# Altium project PWR MOD 1.0 B.PrjPcb
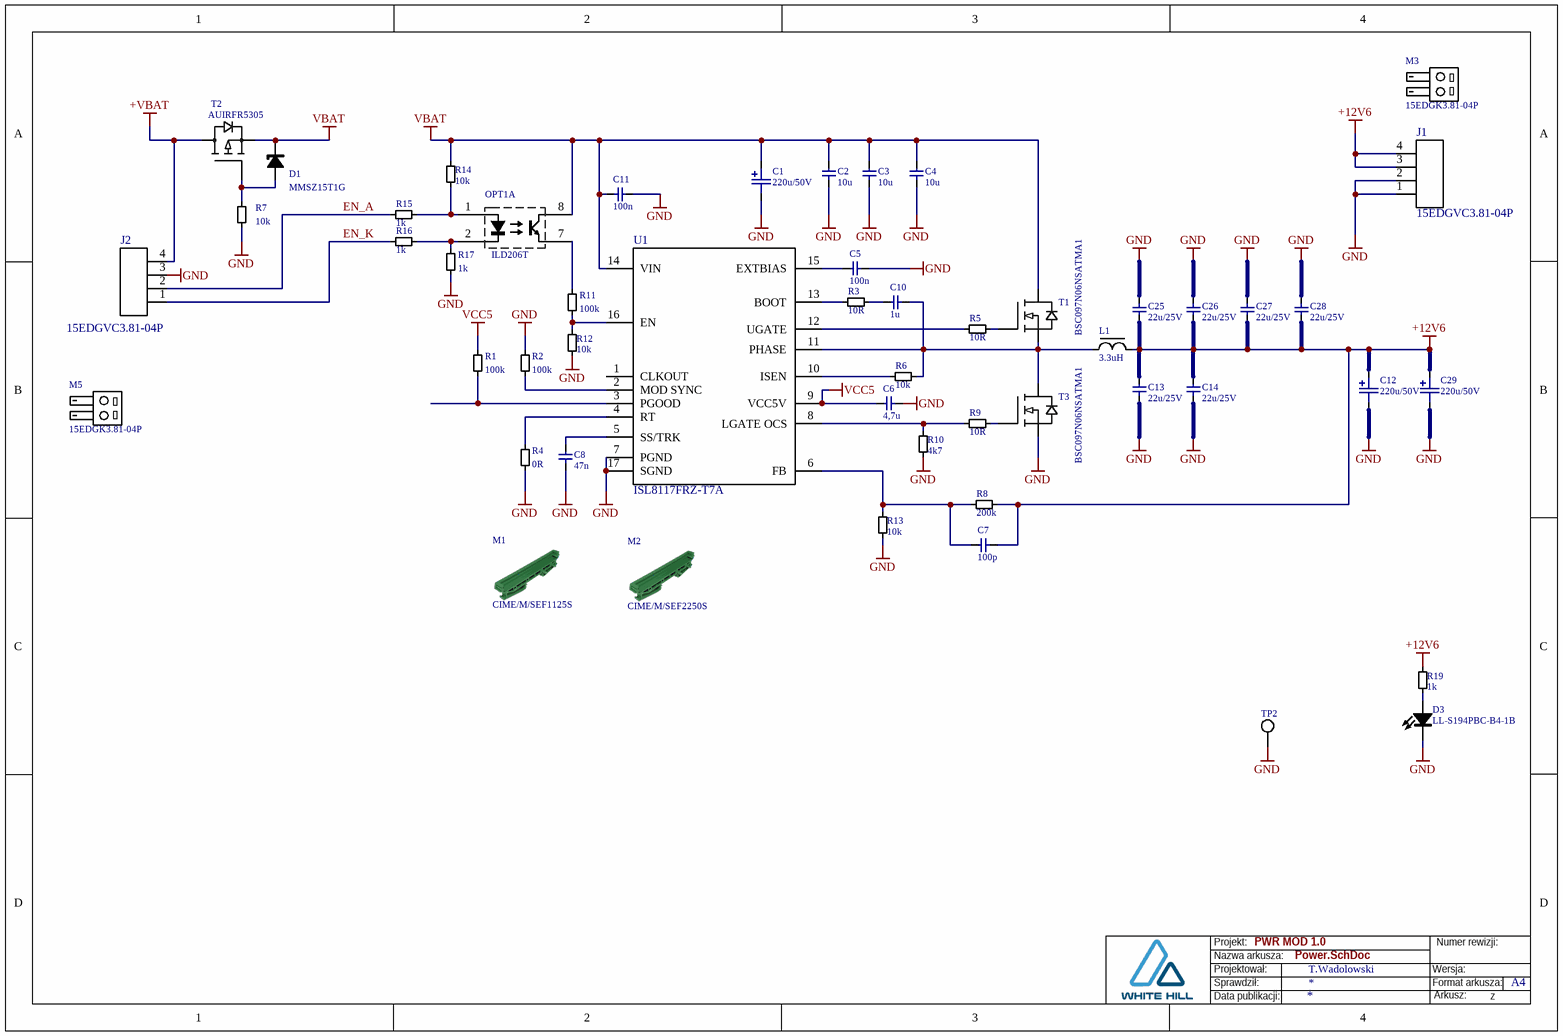
[diagram p0: Power.SchDoc]
PRJ_Title: PWR MOD 1.0
1 sheet, 51 parts. Net scope: global (net labels, ports and power ports of the same name join across sheets).
Board file: PWR MOD 1.0 B.PcbDoc

## Sheet Power.SchDoc
size A4; Engineer: T.Wadolowski; Address1: Whitehill Sp.z o.o Sp.k; Address4: ul.Żurawia 71; DocumentNumber: 1.0

### Parts
C1  220u/50V  [ALU-G]
C2  10u  [C1206]
C3  10u  [C1206]
C4  10u  [C1206]
C5  100n  [C0603]
C6  4,7u  [C0603]
C7  100p  [C0603]
C8  47n  [C0603]
C10  1u  [C0805-10]
C11  100n  [C0603]
C12  220u/50V  [ALU-G]
C13  22u/25V  [C1206]
C14  22u/25V  [C1206]
C25  22u/25V  [C1206]
C26  22u/25V  [C1206]
C27  22u/25V  [C1206]
C28  22u/25V  [C1206]
C29  220u/50V  [ALU-G]
D1  MMSZ15T1G  [SOD123]
D3  LL-S194PBC-B4-1B  [LED0603B]
J1  15EDGVC3.81-04P  [MCV1,5/4-G3,81]
J2  15EDGVC3.81-04P  [MCV1,5/4-G3,81]
L1  3.3uH  [HPI1260]
M1  CIME/M/SEF1125S  (mechanical)
M2  CIME/M/SEF2250S  (mechanical)
M3  15EDGK3.81-04P  (mechanical)
M5  15EDGK3.81-04P  (mechanical)
OPT1  ILD206T  [SO-8-OPT]  (part A of 2)
R1  100k  [R0603]
R2  100k  [R0603]
R3  10R  [R0603]
R4  0R  [R0603]
R5  10R  [R0603]
R6  10k  [R0603]
R7  10k  [R0603]
R8  200k  [R0603]
R9  10R  [R0603]
R10  4k7  [R0603]
R11  100k  [R0603]
R12  10k  [R0603]
R13  10k  [R0603]
R14  10k  [R0603]
R15  1k  [R0603]
R16  1k  [R0603]
R17  1k  [R0603]
R19  1k  [R0603]
T1  BSC097N06NSATMA1  [PowerPAK SO-8]
T2  AUIRFR5305  [DPAK]
T3  BSC097N06NSATMA1  [PowerPAK SO-8]
TP2  TEST-1R  [TP-O]  (value not drawn)
U1  ISL8117FRZ-T7A  [QFN-16-0.5]

### Nets
+12V6: C7.2 C12.1 C13.1 C14.1 C25.1 C26.1 C27.1 C28.1 C29.1 J1.3 J1.4 L1.2 R8.1(TOP) R19.1(TOP)
+VBAT: J2.4 T2.2(D)
GND: C1.2 C2.2 C3.2 C4.2 C5.2 C6.2 C8.2 C11.1 C12.2 C13.2 C14.2 C25.2 C26.2 C27.2 C28.2 C29.2 D3.K J1.1 J1.2 J2.3 R2.2(BOT) R4.2(BOT) R7.2(BOT) R10.1(TOP) R12.2(BOT) R13.2(BOT) R17.1(TOP) T3.S TP2.1 U1.7(PGND) U1.17(SGND)
VBAT: C1.1 C2.1 C3.1 C4.1 C11.2 D1.2(K) OPT1.8 R14.1(TOP) T1.D T2.3(S) U1.14(VIN)
VCC5: C6.1 R1.2(BOT) U1.9(VCC5V)
EN_A: J2.2 R15.1(TOP)
EN_K: J2.1 R16.1(TOP)
NetC5_1: C5.1 U1.15(EXTBIAS)
NetC7_1: C7.1 R8.2(BOT) R13.1(TOP) U1.6(FB)
NetC8_1: C8.1 U1.5(SS/TRK)
NetC10_1: C10.1 R3.1(TOP)
NetC10_2: C10.2 L1.1 R6.1(TOP) T1.S T3.D U1.11(PHASE)
NetD1_1: D1.1(A) R7.1(TOP) T2.1(G)
NetD3_A: D3.A R19.2(BOT)
NetOPT1_1: OPT1.1 R14.2(BOT) R15.2(BOT)
NetOPT1_2: OPT1.2 R16.2(BOT) R17.2(BOT)
NetOPT1_7: OPT1.7 R11.2(BOT)
NetR1_1: R1.1(TOP) U1.3(PGOOD)
NetR2_1: R2.1(TOP) U1.2(MOD_SYNC)
NetR3_2: R3.2(BOT) U1.13(BOOT)
NetR4_1: R4.1(TOP) U1.4(RT)
NetR5_1: R5.1(TOP) T1.G
NetR5_2: R5.2(BOT) U1.12(UGATE)
NetR6_2: R6.2(BOT) U1.10(ISEN)
NetR9_1: R9.1(TOP) T3.G
NetR9_2: R9.2(BOT) R10.2(BOT) U1.8(LGATE_OCS)
NetR11_1: R11.1(TOP) R12.1(TOP) U1.16(EN)

Not connected (* = marked no-connect by the designer): U1 1(CLKOUT)

### Notes on the sheet
- Projektował:
- Sprawdził:
- Projekt:
- Nazwa arkusza:
- Wersja:
- Format arkusza:
- Numer rewizji:
- A4
- Data publikacji:
- Arkusz:
- z

### Library data of the parts
C1 C12 C29 = CAP-EL: Capacitor: electrolytic; low impedance; 220uF; 50VDC; Case: G; Manufacturer: Panasonic; Part Number: EEEFP1H221AP; Value: 220u/50V; ComponentLink1Description: Datasheet; ComponentLink1URL: D:\Datasheets\PANASONIC_FP.pdf; Supplier: TME; Supplier Code: EEEFP1H221AP; ComponentLink2Description: Dostawca; ComponentLink2URL: http://www.tme.eu/pl/katalog/?idp=1&search=EEEFP1H221AP
C2-C4 = C-028: Capacitor: ceramic; 10uF; 50V; X7R; ±10%; SMD; 1206; Manufacturer: Samnsung; Part Number: CL31A106KBHNNNE; Indeks: C-0028; Value: 10u; ComponentLink1Description: Datasheet; ComponentLink1URL: D:\Datasheets\.pdf; Supplier: TME; Supplier Code: CL31A106KBHNNNE; ComponentLink2Description: Dostawca; ComponentLink2URL: http://www.tme.eu/pl/katalog/?idp=1&search=CL31A106KBHNNNE
C5 C11 = C-013: Capacitor: ceramic; 100nF; 50V; X7R; ±10%; SMD; 0603; Series: GRM; Manufacturer: Murata; Part Number: GRM188R71H104KA93D; Indeks: C-0013; Value: 100n; ComponentLink1Description: Datasheet; ComponentLink1URL: D:\Datasheets\.pdf; Supplier: TME; Supplier Code: GRM188R71H104KA93D; ComponentLink2Description: Dostawca; ComponentLink2URL: http://www.tme.eu/pl/katalog/?idp=1&search=GRM188R71H104KA93D
C6 = C-031: Capacitor: ceramic;4,7uF ; 50V; X7R; ±5%; SMD; 0603; Manufacturer: Samsung; Part Number: 0603X475K100CT; Value: 4,7u; ComponentLink1Description: Datasheet; ComponentLink1URL: D:\Datasheets\.pdf; Supplier: TME; Supplier Code: 0603X475K100CT; Indeks: C-031; ComponentLink2Description: Dostawca; ComponentLink2URL: https://www.tme.eu/pl/katalog/?search=0603X475K100CT
C7 = C-005: Capacitor: ceramic; MLCC; 100pF; 50V; C0G; ±1%; SMD; 0603; Manufacturer: Vishay; Part Number: VJ0603A101FXACW1BC; Value: 100p; ComponentLink1Description: Datasheet; ComponentLink1URL: D:\Datasheets\.pdf; Supplier: TME; Supplier Code: VJ0603A101FXACW1BC; Indeks: C-005; ComponentLink2Description: Dostawca; ComponentLink2URL: http://www.tme.eu/pl/katalog/?idp=1&search=VJ0603A101FXACW1BC
C8 = C-012: Capacitor: ceramic; MLCC; 47nF; 50V; X7R; ±10%; SMD; 0603; Manufacturer: Kemet; Part Number: C0603C473K5RACTU; Indeks: C-0012; Value: 47n; ComponentLink1Description: Datasheet; ComponentLink1URL: D:\Datasheets\.pdf; Supplier: TME; Supplier Code: C0603C473K5RAC; ComponentLink2Description: Dostawca; ComponentLink2URL: http://www.tme.eu/pl/katalog/?idp=1&search=C0603C473K5RAC
C10 = C-017: Capacitor: ceramic; MLCC; 1uF; 50V; X7R; SMD; 0805; Manufacturer: Samsung; Part Number: CL21B105KBFNNNG; Indeks: C-0017; Value: 1u; ComponentLink1Description: Datasheet; ComponentLink1URL: D:\Datasheets\.pdf; Supplier: TME; Supplier Code: CL21B105KBFNNNG; ComponentLink2Description: Dostawca; ComponentLink2URL: http://www.tme.eu/pl/katalog/?idp=1&search=CL21F105ZBFNNNE
C13 C14 C25-C28 = C-029: Capacitor: ceramic; 22uF; 25V; X7R; ±10%; SMD; 1206; Manufacturer: Murata; Part Number: GRM31CR61E226KE15L; Indeks: C-0029; Value: 22u/25V; ComponentLink1Description: Datasheet; ComponentLink1URL: D:\Datasheets\.pdf; Supplier: TME; Supplier Code: GRM31CR61E226KE15L; ComponentLink2Description: Dostawca; ComponentLink2URL: http://www.tme.eu/pl/katalog/?idp=1&search=GRM31CR61E226KE15L
D1 = D_ZEN: Dioda: Zenera; 0,5W; 18V; SMD; Manufacturer: ON Semi; Value: MMSZ15T1G; ComponentLink1Description: Datasheet; ComponentLink1URL: D:\Datasheets\MMSZxxxT1G.pdf; Part Number: MMSZ15T1G; Supplier: TME; Supplier Code: MMSZ15T1G; ComponentLink2Description: Dostawca; ComponentLink2URL: http://www.tme.eu/pl/katalog/?idp=1&search=MMSZ15T1G
D3 = LED_1: LED; SMD; 0603; blue; 20-40mcd; 1.6x0.8x0.4mm; 130°; 2.8÷3.8V; 20mA; Manufacturer: LuckyLight; Value: LL-S194PBC-B4-1B; ComponentLink1Description: Datasheet; ComponentLink1URL: D:\Datasheets\.pdf; Part Number: LL-S194PBC-B4-1B; Supplier: TME; Supplier Code: LL-S194PBC-B4-1B; ComponentLink2Description: Dostawca
J1 J2 = CON4: Terminal block; 3.81mm; ways: 4; straight; socket; male; Manufacturer: Degson; Part Number: 15EDGVC-3.81-04P-14-00A(H); Value: 15EDGVC3.81-04P; ComponentLink1Description: Datasheet; ComponentLink1URL: D:\Datasheets\.pdf; Supplier: TME; Supplier Code: 15EDGVC3.81-04P; ComponentLink2Description: Dostawca
L1 = L_HPI_3.3uH: Inductor: wire; SMD; 3.3uH; Ioper:14A; 2.45mOhm; ±20%; Isat:15A; Manufacturer: Ferrocore; Part Number: HPI1260-3R3; Indeks: IND; Supplier: TME; Supplier Code: HPI1260-3R3; ComponentLink1Description: Datasheet; ComponentLink1URL: E:\Datasheets\HPI1260.pdf; ComponentLink2Description: Dostawca; ComponentLink2URL: http://www.tme.eu/pl/katalog/?idp=1&search=HPI1260-3R3; Value: 3.3uH
M1 = Cime 72 11,25mm_Foot: End Section ,Foot Modular Interface Support, 72mm  11.25mm; Manufacturer: Camdenboss; ComponentLink1Description: Datasheet; ComponentLink1URL: D:\Datasheets\Cime107.pdf; Part Number: CIME/M/SEF1125S; Supplier: Farnell; Supplier Code: 1774449; Value: CIME/M/SEF1125S
M2 = Cime 72 22,5mm_Foot: End Section ,Foot Modular Interface Support, 72mm  22,5mm; Manufacturer: Camdenboss; ComponentLink1Description: Datasheet; ComponentLink1URL: D:\Datasheets\Cime107.pdf; Part Number: CIME/M/SEF2250S; Supplier: Farnell; Supplier Code: 1774450; Value: CIME/M/SEF2250S
M3 M5 = Wtyk 3,81: Pluggable terminal block; 3.81mm; ways:4; straight; plug; female; Manufacturer: Degson; Part Number: 15EDGK-3.81-04P-14-00A(H); Value: 15EDGK3.81-04P; ComponentLink1Description: Datasheet; ComponentLink1URL: D:\Datasheets\.pdf; Supplier: TME; Supplier Code: 15EDGK3.81-04P; ComponentLink2Description: Dostawca
OPT1 = Opto_dual: Transoptor; SMD; Kanały:2; Wyj: tranzystorowe; Uizol:4kV; Uce:70V; Manufacturer: VISHAY; ComponentLink1Description: Datasheet; ComponentLink1URL: e:\Datasheets\ild205t.pdf; Part Number: ILD206T; Supplier: TME; Supplier Code: ILD206T; ComponentLink2Description: Dostawca; ComponentLink2URL: http://www.tme.eu/pl/katalog/?idp=1&search=ILD206T; Value: ILD206T
R1 R2 R11 = R-013: Resistor: thick film; SMD; 0603; 100k; 0.125W; ±5%; Manufacturer: Walsin; Part Number: WF06P104JTL; Indeks: R-011; Value: 100k; ComponentLink1Description: Datasheet; ComponentLink1URL: D:\Datasheets\.pdf; Supplier: TME; Supplier Code: WF06P-100K-5%; ComponentLink2Description: Dostawca; ComponentLink2URL: http://www.tme.eu/pl/katalog/?idp=1&search=WF06P-100K-5%; Tolerance: 5%
R3 R5 R9 = R-001: Resistor: thick film; SMD; 0603; 10R; 0.1W; ±5%; Manufacturer: Royal Ohm; Part Number: 0603SAJ0100T5E; Value: 10R; ComponentLink1Description: Datasheet; ComponentLink1URL: D:\Datasheets\.pdf; Supplier: TME; Supplier Code: SMD0603-10R; Indeks: R-001; ComponentLink2Description: Dostawca; ComponentLink2URL: http://www.tme.eu/pl/katalog/?idp=1&search=SMD0603-10R; Tolerance: 5%
R4 = R-018: Resistor: thick film; SMD; 0603; 0R; 0.125W; ±5%; Manufacturer: Royal Ohm; Part Number: CRCW06030000Z0TABC; Tolerance: 1%; Value: 0R; ComponentLink1Description: Datasheet; ComponentLink1URL: D:\Datasheets\.pdf; Supplier: TME; Supplier Code: CRCW06030000Z0TABC; Indeks: R-018; ComponentLink2Description: Dostawca; ComponentLink2URL: http://www.tme.eu/pl/katalog/?idp=1&search=CRCW06030000Z0TABC
R6 R7 R12-R14 = R-012: Resistor: thick film; SMD; 0603; 10k; 0.125W; ±5%; Manufacturer: Walsin; Part Number: WF06P103JTL; Indeks: R-011; Value: 10k; ComponentLink1Description: Datasheet; ComponentLink1URL: D:\Datasheets\.pdf; Supplier: TME; Supplier Code: WF06P-10K-5%; ComponentLink2Description: Dostawca; ComponentLink2URL: http://www.tme.eu/pl/katalog/?idp=1&search=WF06P-10K-5%; Tolerance: 5%
R8 = R-042: Resistor: thick film; SMD; 0805; 200k; 0.125W; ±5%;; Manufacturer: Royal Ohm; Part Number: 0603SAJ0204T5E; Value: 200k; ComponentLink1Description: Datasheet; ComponentLink1URL: D:\Datasheets\.pdf; Supplier: TME; Supplier Code: SMD0603-200K; Indeks: R-042; ComponentLink2Description: Dostawca; ComponentLink2URL: http://www.tme.eu/pl/katalog/?idp=1&search=CS05JTGVR220; Tolerance: 5%
R10 = R-011: Resistor: thick film; SMD; 0603; 4.7k; 0.125W; ±5%; Manufacturer: Walsin; Part Number: WF06P472JTL; Value: 4k7; ComponentLink1Description: Datasheet; ComponentLink1URL: D:\Datasheets\.pdf; Supplier: TME; Supplier Code: WF06P-4K7-5%; Indeks: R-011; ComponentLink2Description: Dostawca; ComponentLink2URL: http://www.tme.eu/pl/katalog/?idp=1&search=WF06P-4K7-5%; Tolerance: 5%
R15-R17 R19 = R-005: Resistor: thick film; SMD; 0603; 1k; 0.1W; ±5%; Manufacturer: Royal Ohm; Part Number: 0603SAJ0102T5E; Indeks: R-004; Value: 1k; ComponentLink1Description: Datasheet; ComponentLink1URL: D:\Datasheets\.pdf; Supplier: TME; Supplier Code: SMD0603-1K; ComponentLink2Description: Dostawca; ComponentLink2URL: http://www.tme.eu/pl/katalog/?idp=1&search=SMD0603-1K; Tolerance: 5%
T1 T3 = NVMFS5C426NAFT1G: Transistor N MOS 60V;10 mOhm;46A; Manufacturer: Infineon; Indeks: TRAN; Value: BSC097N06NSATMA1; Supplier: TME; Supplier Code: BSC097N06NSATMA1; ComponentLink1Description: Datasheet; ComponentLink1URL: E:\Datasheets\NVMFS5C426NAFT1G.pdf; Part Number: BSC097N06NSATMA1; ComponentLink2Description: Dostawca; ComponentLink2URL: https://pl.mouser.com/ProductDetail/ON-Semiconductor/NVMFS5C426NAFT1G?qs=%2fha2pyFadugLwIkhTqkZTOZfrb%252b8fUFxyykPvHBDJB%2fODM3St1Y24x7PSds6Ow9j
T2 = IRFR5410PBF: Transistor: P-MOSFET; unipolar; -55V; -31A; 110W; DPAK; Manufacturer: IR; Indeks: TRAN; Supplier: TME; Supplier Code: AUIRFR5305; ComponentLink1Description: Datasheet; ComponentLink1URL: D:\Datasheets\IPD042P03L3GBTMA1.pdf; Part Number: AUIRFR5305; ComponentLink2Description: Dostawca; ComponentLink2URL: http://www.tme.eu/pl/katalog/?idp=1&search=IPD042P03L3GBTMA1; Value: AUIRFR5305
TP2 = TP_O: Sprezynka pomiarowa czerwona; Value: TEST-1R; ComponentLink1Description: Datasheet; ComponentLink1URL: D:\Datasheets\.pdf; Part Number: TEST-1R; Supplier: TME; Supplier Code: TEST-1R; ComponentLink2Description: Dostawca
U1 = ISL8117: Synchronous Step-Down PWM Controller 60V 2MHz; Manufacturer: Renesas; Uwagi: Z literka A zewnętrnz komp. unikać; Value: ISL8117FRZ-T7A; ComponentLink1Description: Datasheet; ComponentLink1URL: E:\Datasheets\isl8117.pdf; Part Number: ISL8117FRZ-T7A; Supplier: Farnell; Supplier Code: 2543368; ComponentLink2Description: Dostawca; ComponentLink2URL: https://pl.farnell.com/search?st=ISL8117FRZ

## Assembly variants
STD: not fitted R6 R16 R30 R33 R56 R57 R?